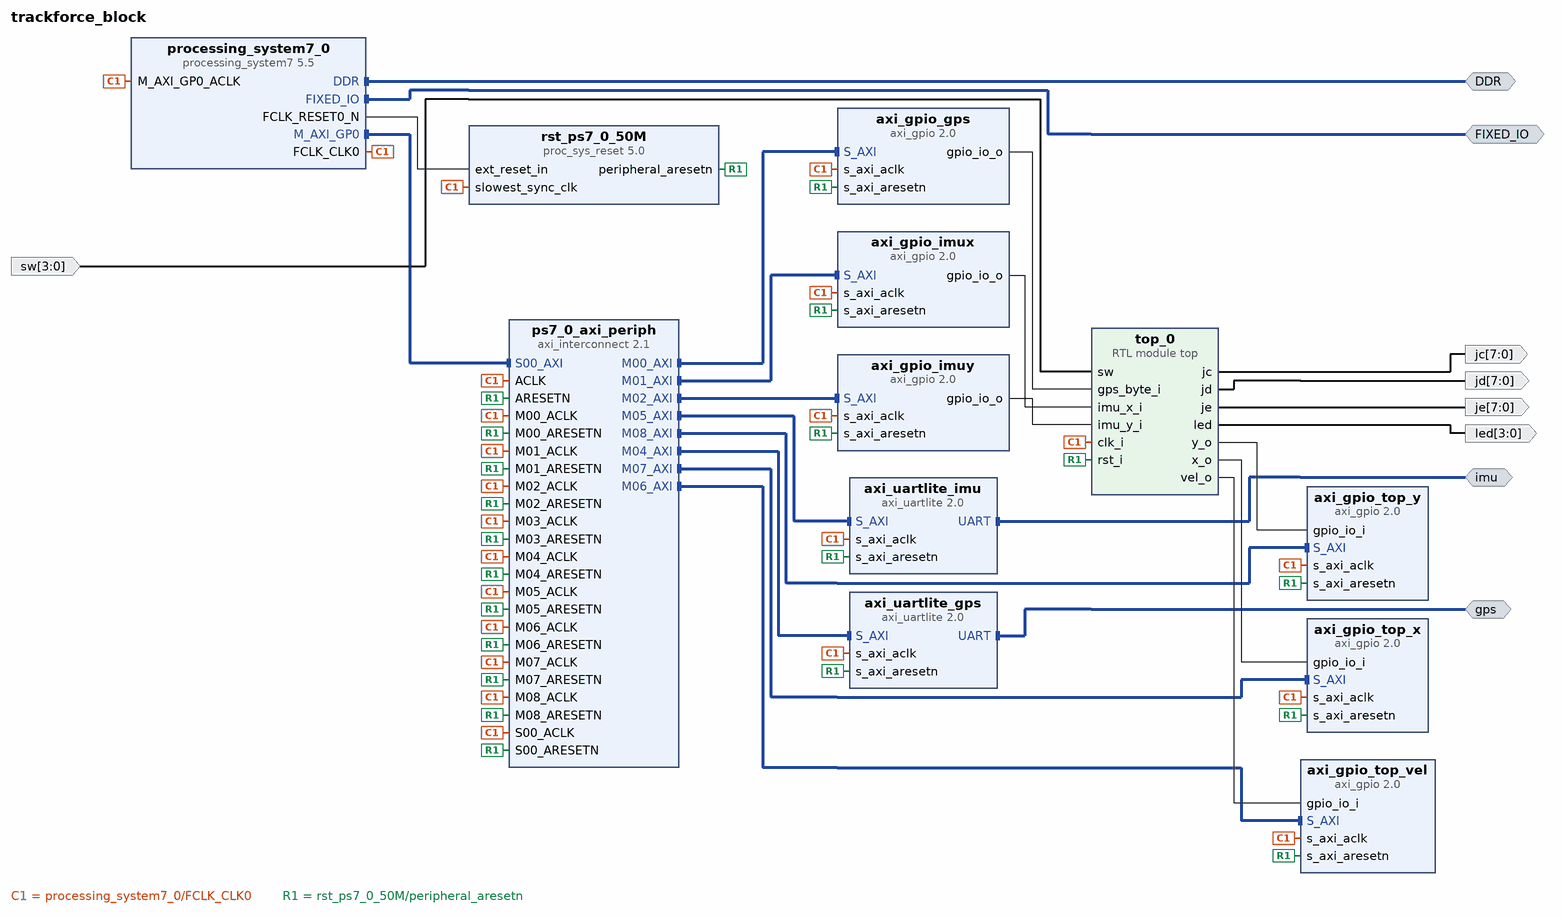
[diagram p0: block diagram of the top level]
# Vivado block design trackforce_block, xc7z020clg400-1, Vivado 2023.2
create_bd_design trackforce_block

create_bd_intf_port -mode Master -vlnv xilinx.com:interface:ddrx_rtl:1.0 DDR
create_bd_intf_port -mode Master -vlnv xilinx.com:display_processing_system7:fixedio_rtl:1.0 FIXED_IO
create_bd_intf_port -mode Master -vlnv xilinx.com:interface:uart_rtl:1.0 gps
create_bd_intf_port -mode Master -vlnv xilinx.com:interface:uart_rtl:1.0 imu
create_bd_port -dir O -from 3 -to 0 led
create_bd_port -dir O -from 7 -to 0 jc
create_bd_port -dir O -from 7 -to 0 jd
create_bd_port -dir O -from 7 -to 0 je
create_bd_port -dir I -from 3 -to 0 sw

create_bd_cell -type ip -vlnv xilinx.com:ip:processing_system7:5.5 processing_system7_0
set_property -dict [list \
  CONFIG.PCW_APU_PERIPHERAL_FREQMHZ 666.666666 \
  CONFIG.PCW_ENET0_ENET0_IO {MIO 16 .. 27} \
  CONFIG.PCW_ENET0_GRP_MDIO_ENABLE 1 \
  CONFIG.PCW_ENET0_GRP_MDIO_IO {MIO 52 .. 53} \
  CONFIG.PCW_ENET0_PERIPHERAL_ENABLE 1 \
  CONFIG.PCW_ENET0_RESET_ENABLE 0 \
  CONFIG.PCW_ENET_RESET_ENABLE 1 \
  CONFIG.PCW_ENET_RESET_SELECT {Share reset pin} \
  CONFIG.PCW_FPGA0_PERIPHERAL_FREQMHZ 100 \
  CONFIG.PCW_GPIO_MIO_GPIO_ENABLE 1 \
  CONFIG.PCW_GPIO_MIO_GPIO_IO MIO \
  CONFIG.PCW_I2C_RESET_ENABLE 1 \
  CONFIG.PCW_PRESET_BANK1_VOLTAGE {LVCMOS 1.8V} \
  CONFIG.PCW_QSPI_GRP_FBCLK_ENABLE 1 \
  CONFIG.PCW_QSPI_GRP_FBCLK_IO {MIO 8} \
  CONFIG.PCW_QSPI_GRP_SINGLE_SS_ENABLE 1 \
  CONFIG.PCW_QSPI_GRP_SINGLE_SS_IO {MIO 1 .. 6} \
  CONFIG.PCW_QSPI_PERIPHERAL_ENABLE 1 \
  CONFIG.PCW_QSPI_QSPI_IO {MIO 1 .. 6} \
  CONFIG.PCW_SD0_GRP_CD_ENABLE 1 \
  CONFIG.PCW_SD0_GRP_CD_IO {MIO 47} \
  CONFIG.PCW_SD0_GRP_WP_ENABLE 0 \
  CONFIG.PCW_SD0_PERIPHERAL_ENABLE 1 \
  CONFIG.PCW_SD0_SD0_IO {MIO 40 .. 45} \
  CONFIG.PCW_SDIO_PERIPHERAL_FREQMHZ 50 \
  CONFIG.PCW_SINGLE_QSPI_DATA_MODE x4 \
  CONFIG.PCW_UART1_PERIPHERAL_ENABLE 1 \
  CONFIG.PCW_UART1_UART1_IO {MIO 48 .. 49} \
  CONFIG.PCW_UART_PERIPHERAL_FREQMHZ 100 \
  CONFIG.PCW_UIPARAM_DDR_FREQ_MHZ 533.333333 \
  CONFIG.PCW_UIPARAM_DDR_MEMORY_TYPE {DDR 3 (Low Voltage)} \
  CONFIG.PCW_UIPARAM_DDR_PARTNO {MT41K256M16 RE-125} \
  CONFIG.PCW_USB0_PERIPHERAL_ENABLE 1 \
  CONFIG.PCW_USB0_RESET_ENABLE 1 \
  CONFIG.PCW_USB0_RESET_IO {MIO 46} \
  CONFIG.PCW_USB0_USB0_IO {MIO 28 .. 39} \
  CONFIG.PCW_USB_RESET_ENABLE 1 \
  CONFIG.PCW_USB_RESET_SELECT {Share reset pin} \
] [get_bd_cells processing_system7_0]
# 299 more settings of processing_system7_0 are not shown: defaults, MIO pin electricals, DDR timing, and values the tool derives
create_bd_cell -type module -reference top top_0
create_bd_cell -type ip -vlnv xilinx.com:ip:axi_gpio:2.0 axi_gpio_gps
set_property -dict {CONFIG.C_ALL_OUTPUTS 1 CONFIG.C_DOUT_DEFAULT 0x00000101 CONFIG.C_GPIO_WIDTH 8} [get_bd_cells axi_gpio_gps]
create_bd_cell -type ip -vlnv xilinx.com:ip:axi_gpio:2.0 axi_gpio_imux
set_property -dict {CONFIG.C_ALL_OUTPUTS 1 CONFIG.C_DOUT_DEFAULT 0x00000101 CONFIG.C_GPIO_WIDTH 8} [get_bd_cells axi_gpio_imux]
create_bd_cell -type ip -vlnv xilinx.com:ip:axi_gpio:2.0 axi_gpio_imuy
set_property -dict {CONFIG.C_ALL_OUTPUTS 1 CONFIG.C_DOUT_DEFAULT 0x00000101 CONFIG.C_GPIO_WIDTH 8} [get_bd_cells axi_gpio_imuy]
create_bd_cell -type ip -vlnv xilinx.com:ip:axi_interconnect:2.1 ps7_0_axi_periph
set_property -dict {CONFIG.NUM_MI 9} [get_bd_cells ps7_0_axi_periph]
create_bd_cell -type ip -vlnv xilinx.com:ip:proc_sys_reset:5.0 rst_ps7_0_50M
create_bd_cell -type ip -vlnv xilinx.com:ip:axi_uartlite:2.0 axi_uartlite_gps
set_property -dict {CONFIG.C_BAUDRATE 38400} [get_bd_cells axi_uartlite_gps]
create_bd_cell -type ip -vlnv xilinx.com:ip:axi_uartlite:2.0 axi_uartlite_imu
set_property -dict {CONFIG.C_BAUDRATE 115200} [get_bd_cells axi_uartlite_imu]
create_bd_cell -type ip -vlnv xilinx.com:ip:axi_gpio:2.0 axi_gpio_top_vel
set_property -dict {CONFIG.C_ALL_INPUTS 1 CONFIG.C_GPIO_WIDTH 8} [get_bd_cells axi_gpio_top_vel]
create_bd_cell -type ip -vlnv xilinx.com:ip:axi_gpio:2.0 axi_gpio_top_x
set_property -dict {CONFIG.C_ALL_INPUTS 1 CONFIG.C_GPIO_WIDTH 8} [get_bd_cells axi_gpio_top_x]
create_bd_cell -type ip -vlnv xilinx.com:ip:axi_gpio:2.0 axi_gpio_top_y
set_property -dict {CONFIG.C_ALL_INPUTS 1 CONFIG.C_GPIO_WIDTH 8} [get_bd_cells axi_gpio_top_y]

# ---- connections ----

connect_bd_intf_net [get_bd_intf_ports gps] [get_bd_intf_pins axi_uartlite_gps/UART]
connect_bd_intf_net [get_bd_intf_ports imu] [get_bd_intf_pins axi_uartlite_imu/UART]
connect_bd_intf_net [get_bd_intf_ports DDR] [get_bd_intf_pins processing_system7_0/DDR]
connect_bd_intf_net [get_bd_intf_ports FIXED_IO] [get_bd_intf_pins processing_system7_0/FIXED_IO]
connect_bd_intf_net [get_bd_intf_pins processing_system7_0/M_AXI_GP0] [get_bd_intf_pins ps7_0_axi_periph/S00_AXI]
connect_bd_intf_net [get_bd_intf_pins ps7_0_axi_periph/M00_AXI] [get_bd_intf_pins axi_gpio_gps/S_AXI]
connect_bd_intf_net [get_bd_intf_pins ps7_0_axi_periph/M01_AXI] [get_bd_intf_pins axi_gpio_imux/S_AXI]
connect_bd_intf_net [get_bd_intf_pins ps7_0_axi_periph/M02_AXI] [get_bd_intf_pins axi_gpio_imuy/S_AXI]
connect_bd_intf_net [get_bd_intf_pins ps7_0_axi_periph/M04_AXI] [get_bd_intf_pins axi_uartlite_gps/S_AXI]
connect_bd_intf_net [get_bd_intf_pins ps7_0_axi_periph/M05_AXI] [get_bd_intf_pins axi_uartlite_imu/S_AXI]
connect_bd_intf_net [get_bd_intf_pins ps7_0_axi_periph/M06_AXI] [get_bd_intf_pins axi_gpio_top_vel/S_AXI]
connect_bd_intf_net [get_bd_intf_pins ps7_0_axi_periph/M07_AXI] [get_bd_intf_pins axi_gpio_top_x/S_AXI]
connect_bd_intf_net [get_bd_intf_pins ps7_0_axi_periph/M08_AXI] [get_bd_intf_pins axi_gpio_top_y/S_AXI]
connect_bd_net [get_bd_pins axi_gpio_gps/gpio_io_o] [get_bd_pins top_0/gps_byte_i]
connect_bd_net [get_bd_pins axi_gpio_imux/gpio_io_o] [get_bd_pins top_0/imu_x_i]
connect_bd_net [get_bd_pins axi_gpio_imuy/gpio_io_o] [get_bd_pins top_0/imu_y_i]
connect_bd_net [get_bd_pins processing_system7_0/FCLK_CLK0] \
  [get_bd_pins axi_gpio_gps/s_axi_aclk] [get_bd_pins ps7_0_axi_periph/M00_ACLK] [get_bd_pins axi_gpio_imux/s_axi_aclk] \
  [get_bd_pins ps7_0_axi_periph/M01_ACLK] [get_bd_pins axi_gpio_imuy/s_axi_aclk] [get_bd_pins ps7_0_axi_periph/M02_ACLK] \
  [get_bd_pins ps7_0_axi_periph/M03_ACLK] [get_bd_pins axi_uartlite_gps/s_axi_aclk] [get_bd_pins ps7_0_axi_periph/M04_ACLK] \
  [get_bd_pins axi_uartlite_imu/s_axi_aclk] [get_bd_pins ps7_0_axi_periph/M05_ACLK] \
  [get_bd_pins processing_system7_0/M_AXI_GP0_ACLK] [get_bd_pins ps7_0_axi_periph/S00_ACLK] \
  [get_bd_pins ps7_0_axi_periph/ACLK] [get_bd_pins rst_ps7_0_50M/slowest_sync_clk] [get_bd_pins axi_gpio_top_vel/s_axi_aclk] \
  [get_bd_pins ps7_0_axi_periph/M06_ACLK] [get_bd_pins axi_gpio_top_x/s_axi_aclk] [get_bd_pins ps7_0_axi_periph/M07_ACLK] \
  [get_bd_pins axi_gpio_top_y/s_axi_aclk] [get_bd_pins ps7_0_axi_periph/M08_ACLK] [get_bd_pins top_0/clk_i]
connect_bd_net [get_bd_pins processing_system7_0/FCLK_RESET0_N] [get_bd_pins rst_ps7_0_50M/ext_reset_in]
connect_bd_net [get_bd_pins rst_ps7_0_50M/peripheral_aresetn] \
  [get_bd_pins ps7_0_axi_periph/S00_ARESETN] [get_bd_pins axi_gpio_gps/s_axi_aresetn] \
  [get_bd_pins ps7_0_axi_periph/M00_ARESETN] [get_bd_pins ps7_0_axi_periph/ARESETN] [get_bd_pins axi_gpio_imux/s_axi_aresetn] \
  [get_bd_pins ps7_0_axi_periph/M01_ARESETN] [get_bd_pins axi_gpio_imuy/s_axi_aresetn] \
  [get_bd_pins ps7_0_axi_periph/M02_ARESETN] [get_bd_pins ps7_0_axi_periph/M03_ARESETN] \
  [get_bd_pins axi_uartlite_gps/s_axi_aresetn] [get_bd_pins ps7_0_axi_periph/M04_ARESETN] \
  [get_bd_pins axi_uartlite_imu/s_axi_aresetn] [get_bd_pins ps7_0_axi_periph/M05_ARESETN] \
  [get_bd_pins axi_gpio_top_vel/s_axi_aresetn] [get_bd_pins ps7_0_axi_periph/M06_ARESETN] \
  [get_bd_pins axi_gpio_top_x/s_axi_aresetn] [get_bd_pins ps7_0_axi_periph/M07_ARESETN] \
  [get_bd_pins axi_gpio_top_y/s_axi_aresetn] [get_bd_pins ps7_0_axi_periph/M08_ARESETN] [get_bd_pins top_0/rst_i]
connect_bd_net -net sw_0_1 [get_bd_ports sw] [get_bd_pins top_0/sw]
connect_bd_net [get_bd_pins top_0/jc] [get_bd_ports jc]
connect_bd_net [get_bd_pins top_0/jd] [get_bd_ports jd]
connect_bd_net [get_bd_pins top_0/je] [get_bd_ports je]
connect_bd_net [get_bd_pins top_0/led] [get_bd_ports led]
connect_bd_net [get_bd_pins top_0/vel_o] [get_bd_pins axi_gpio_top_vel/gpio_io_i]
connect_bd_net [get_bd_pins top_0/x_o] [get_bd_pins axi_gpio_top_x/gpio_io_i]
connect_bd_net [get_bd_pins top_0/y_o] [get_bd_pins axi_gpio_top_y/gpio_io_i]

# ---- address map ----
assign_bd_address -offset 0x41200000 -range 64K -target_address_space [get_bd_addr_spaces processing_system7_0/Data] [get_bd_addr_segs axi_gpio_gps/S_AXI/Reg]
assign_bd_address -offset 0x41210000 -range 64K -target_address_space [get_bd_addr_spaces processing_system7_0/Data] [get_bd_addr_segs axi_gpio_imux/S_AXI/Reg]
assign_bd_address -offset 0x41220000 -range 64K -target_address_space [get_bd_addr_spaces processing_system7_0/Data] [get_bd_addr_segs axi_gpio_imuy/S_AXI/Reg]
assign_bd_address -offset 0x41240000 -range 64K -target_address_space [get_bd_addr_spaces processing_system7_0/Data] [get_bd_addr_segs axi_gpio_top_vel/S_AXI/Reg]
assign_bd_address -offset 0x41250000 -range 64K -target_address_space [get_bd_addr_spaces processing_system7_0/Data] [get_bd_addr_segs axi_gpio_top_x/S_AXI/Reg]
assign_bd_address -offset 0x41260000 -range 64K -target_address_space [get_bd_addr_spaces processing_system7_0/Data] [get_bd_addr_segs axi_gpio_top_y/S_AXI/Reg]
assign_bd_address -offset 0x42C00000 -range 64K -target_address_space [get_bd_addr_spaces processing_system7_0/Data] [get_bd_addr_segs axi_uartlite_gps/S_AXI/Reg]
assign_bd_address -offset 0x42C10000 -range 64K -target_address_space [get_bd_addr_spaces processing_system7_0/Data] [get_bd_addr_segs axi_uartlite_imu/S_AXI/Reg]

validate_bd_design
save_bd_design
